# EAGLE design UMN_HASP_2015_HVPS (EAGLE 6.5.0)

## Sheet 1 of 3: HVPS A
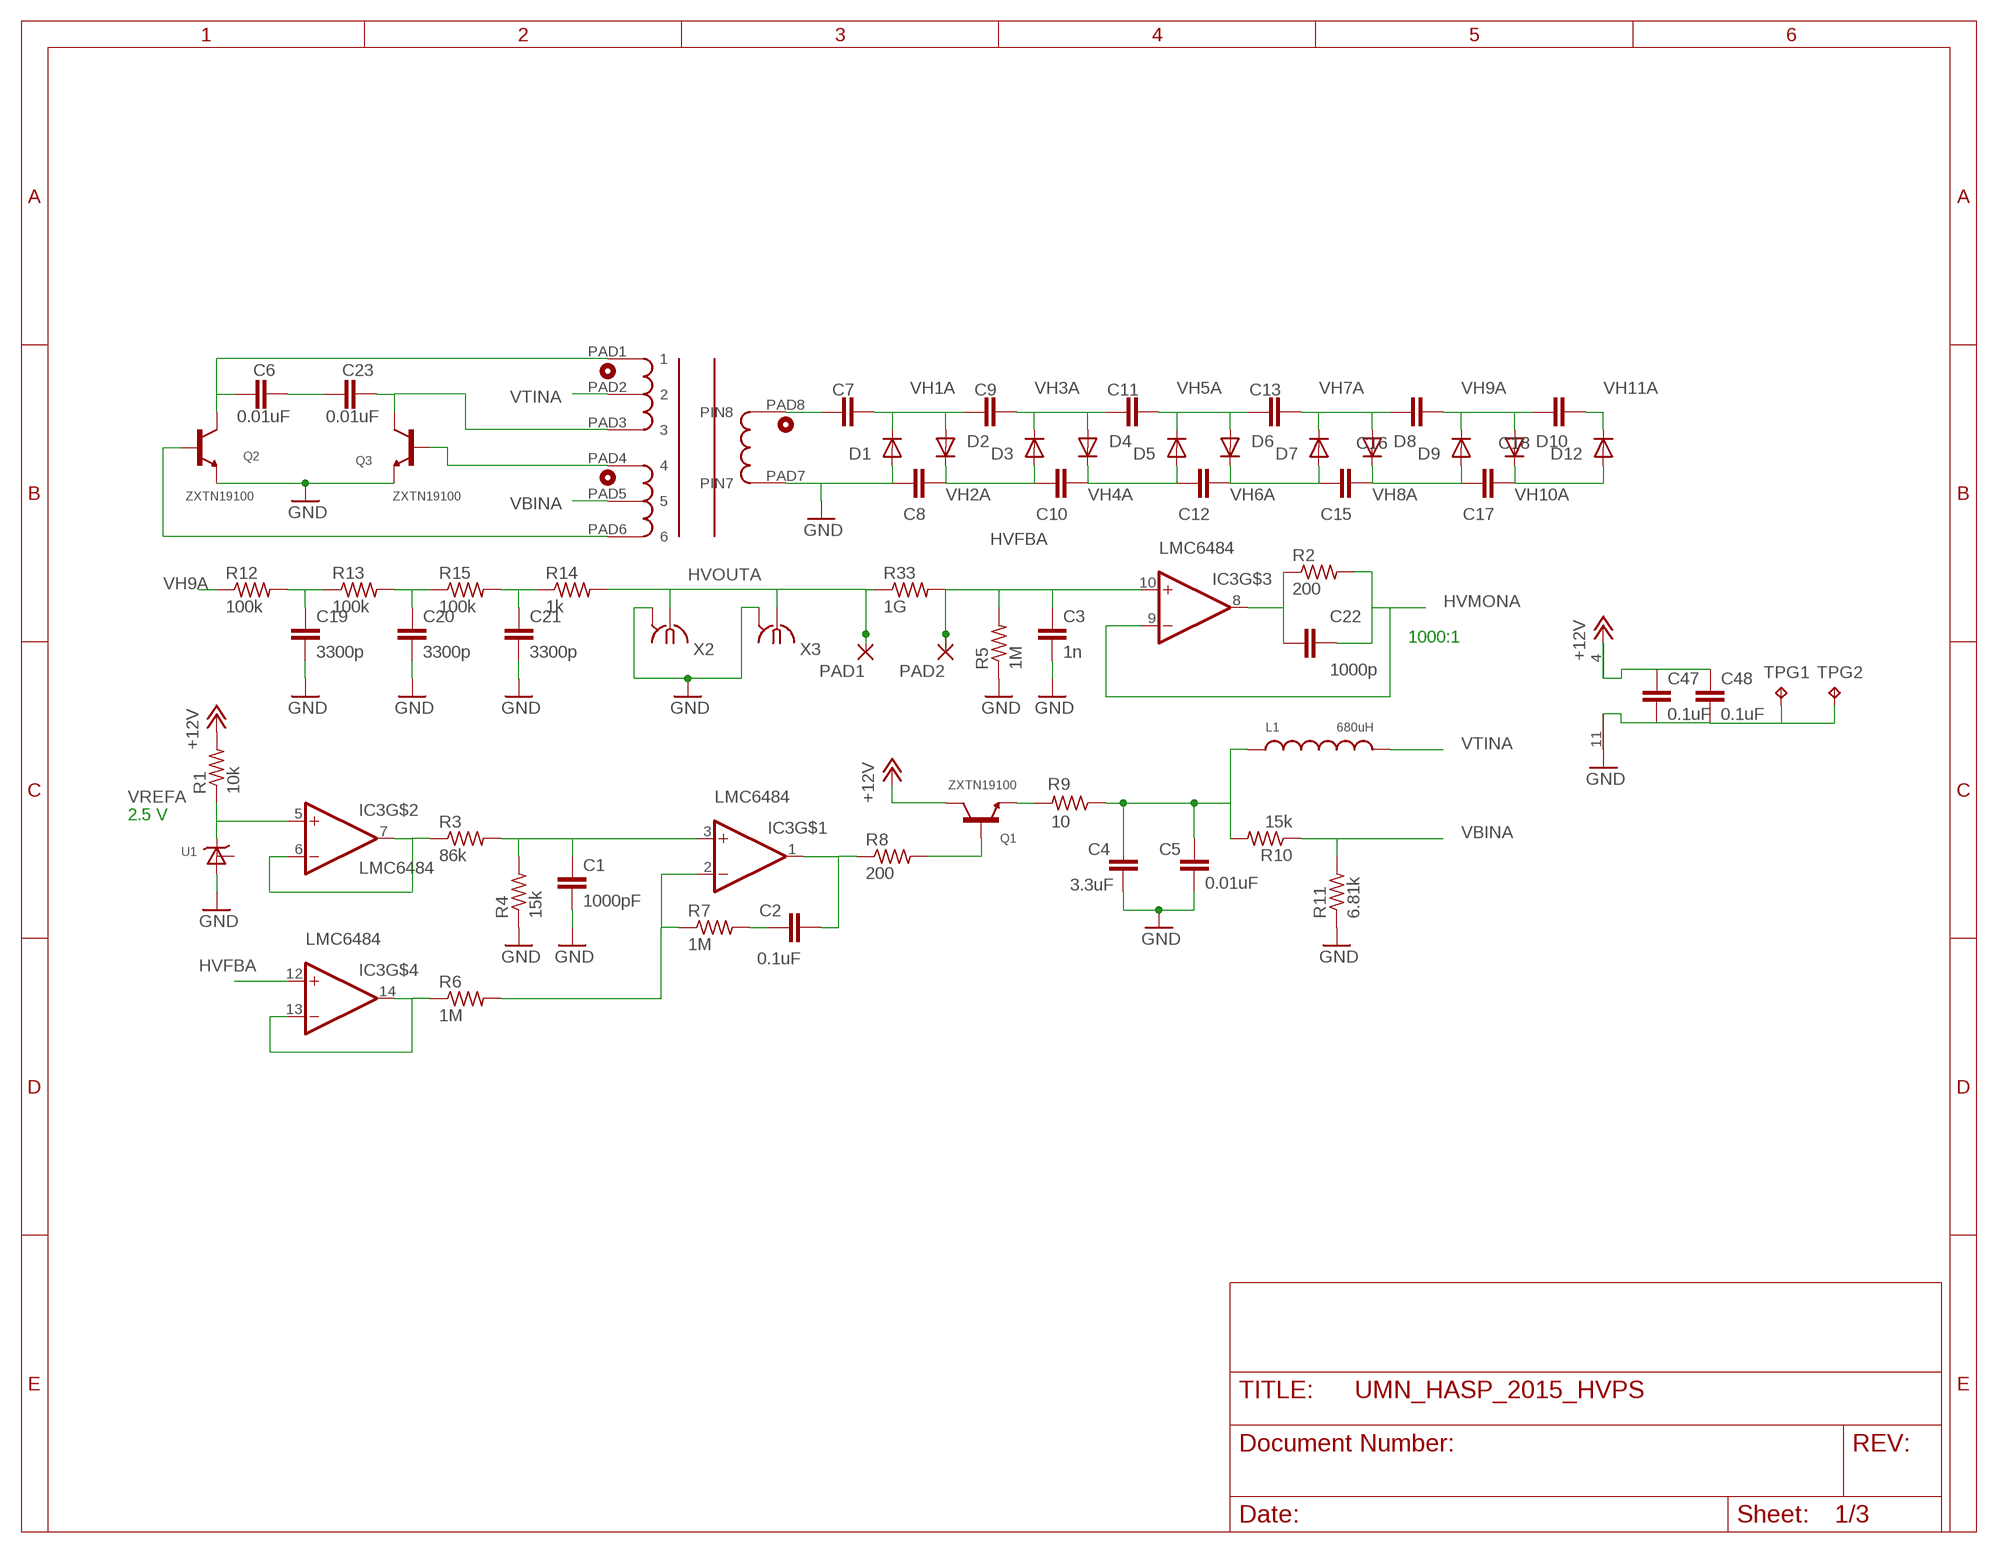
[diagram p0: schematic, sheet 1]

### Parts
C1  1000pF  C-EUC0603  [C0603]
C2  0.1uF  C-EUC0603  [C0603]
C3  1n  C-EUC0603  [C0603]
C4  3.3uF  C-EUC0603  [C0603]
C5  0.01uF  C-EUC0603  [C0603]
C6  0.01uF  C-EUC0603  [C0603]
C7  C-EUC1206K  [C1206K]
C8  C-EUC1206K  [C1206K]
C9  C-EUC1206K  [C1206K]
C10  C-EUC1206K  [C1206K]
C11  C-EUC1206K  [C1206K]
C12  C-EUC1206K  [C1206K]
C13  C-EUC1206K  [C1206K]
C15  C-EUC1206K  [C1206K]
C16  C-EUC1206K  [C1206K]
C17  C-EUC1206K  [C1206K]
C18  C-EUC1206K  [C1206K]
C19  3300p  C-EUC1206  [C1206]
C20  3300p  C-EUC1206  [C1206]
C21  3300p  C-EUC1206  [C1206]
C22  1000p  C-EUC0603  [C0603]
C23  0.01uF  C-EUC0603  [C0603]
C47  0.1uF  C-EUC0603  [C0603]
C48  0.1uF  C-EUC0603  [C0603]
D1  DIODE-DO-214AC  [DO-214AC]
D2  DIODE-DO-214AC  [DO-214AC]
D3  DIODE-DO-214AC  [DO-214AC]
D4  DIODE-DO-214AC  [DO-214AC]
D5  DIODE-DO-214AC  [DO-214AC]
D6  DIODE-DO-214AC  [DO-214AC]
D7  DIODE-DO-214AC  [DO-214AC]
D8  DIODE-DO-214AC  [DO-214AC]
D9  DIODE-DO-214AC  [DO-214AC]
D10  DIODE-DO-214AC  [DO-214AC]
D12  DIODE-DO-214AC  [DO-214AC]
IC3  LMC6484  [SO14]
L1  680uH  INDUCTOR_BOURNS_SRR1280_SERIES  [INDUCTOR_SRR1280BOURNS]
PAD1  WIREPADSMD1,27-254  [SMD1,27-2,54]
PAD2  WIREPADSMD1,27-254  [SMD1,27-2,54]
Q1  ZXTN19100  ZXTN19100_NPN  [SOT23_2CM_SQ_AREA]
Q2  ZXTN19100  ZXTN19100_NPN  [SOT23_2CM_SQ_AREA]
Q3  ZXTN19100  ZXTN19100_NPN  [SOT23_2CM_SQ_AREA]
R1  10k  R-US_R0603  [R0603]
R2  200  R-US_R0603  [R0603]
R3  86k  R-US_R0603  [R0603]
R4  15k  R-US_R0603  [R0603]
R5  1M  R-US_R0603  [R0603]
R6  1M  R-US_R0603  [R0603]
R7  1M  R-US_R0603  [R0603]
R8  200  R-US_R0603  [R0603]
R9  10  R-US_R2010  [R2010]
R10  15k  R-US_R0603  [R0603]
R11  6.81k  R-US_R0603  [R0603]
R12  100k  R-US_R0603  [R0603]
R13  100k  R-US_R0603  [R0603]
R14  1k  R-US_R0603  [R0603]
R15  100k  R-US_R0603  [R0603]
R33  1G  R-US_R2512  [R2512]
TPG1  TPB1,27  [B1,27]
TPG2  TPB1,27  [B1,27]
U1  ADR525  [SOT23A]
U$1  TDK_TRANSFORMER_RM6_CORE  [SM_DCOILFORMER_RM6]
X2  BU-SMA-V-REVB  [BU-SMA-V]
X3  BU-SMA-V-REVB  [BU-SMA-V]

### Nets
+12V: C47.1 C48.1 IC3.4(V+) Q1.C R1.2 ; also sheet 2,3
GND: C1.2 C3.2 C4.2 C5.2 C8.1 C19.2 C20.2 C21.2 C47.2 C48.2 D1.A IC3.11(V-) Q2.E Q3.E R4.1 R5.1 R11.1 TPG1.TP TPG2.TP U1.2(V-) U$1.PAD7(PIN7) X2.2(GND) X3.2(GND) ; also sheet 2,3
HVFBA: C3.1 IC3.10(+IN) IC3.12(+IN) PAD2.1(P) R5.2 R33.2
HVMONA: C22.1 IC3.9(-IN) R2.2
HVOUTA: PAD1.1(P) R14.2 R33.1 X2.1 X3.1
N$1: C22.2 IC3.8(OUT) R2.1
N$2: IC3.6(-IN) IC3.7(OUT) R3.1
N$3: C1.1 IC3.3(+IN) R3.2 R4.2
N$4: C6.1 C23.2
N$5: IC3.13(-IN) IC3.14(OUT) R6.1
N$6: IC3.2(-IN) R6.2 R7.1
N$7: C6.2 Q2.C U$1.PAD1
N$8: C2.1 R7.2
N$9: C2.2 IC3.1(OUT) R8.1
N$10: C4.1 C5.1 L1.P$1 R9.1 R10.2
N$12: C7.1 U$1.PAD8(PIN8)
N$13: C23.1 Q3.C U$1.PAD3
N$14: C19.1 R12.2 R13.1
N$15: C20.1 R13.2 R15.1
N$16: C21.1 R14.1 R15.2
N$17: Q1.E R9.2
N$18: Q1.B R8.2
N$19: Q3.B U$1.PAD4
N$20: Q2.B U$1.PAD6
VBINA: R10.1 R11.2 U$1.PAD5
VH1A: C7.2 C9.1 D1.C D2.A
VH2A: C8.2 C10.1 D2.C D3.A
VH3A: C9.2 C11.1 D3.C D4.A
VH4A: C10.2 C12.1 D4.C D5.A
VH5A: C11.2 C13.1 D5.C D6.A
VH6A: C12.2 C15.1 D6.C D7.A
VH7A: C13.2 C16.1 D7.C D8.A
VH8A: C15.2 C17.1 D8.C D9.A
VH9A: C16.2 C18.1 D9.C D10.A R12.1
VH10A: C17.2 D10.C D12.A
VH11A: C18.2 D12.C
VREFA: IC3.5(+IN) R1.1 U1.1(V+)
VTINA: L1.P$2 U$1.PAD2
Unconnected: U1.3(TRIM)

### Notes on the sheet
- 1000:1
- 2.5 V

## Sheet 2 of 3: HVPS B
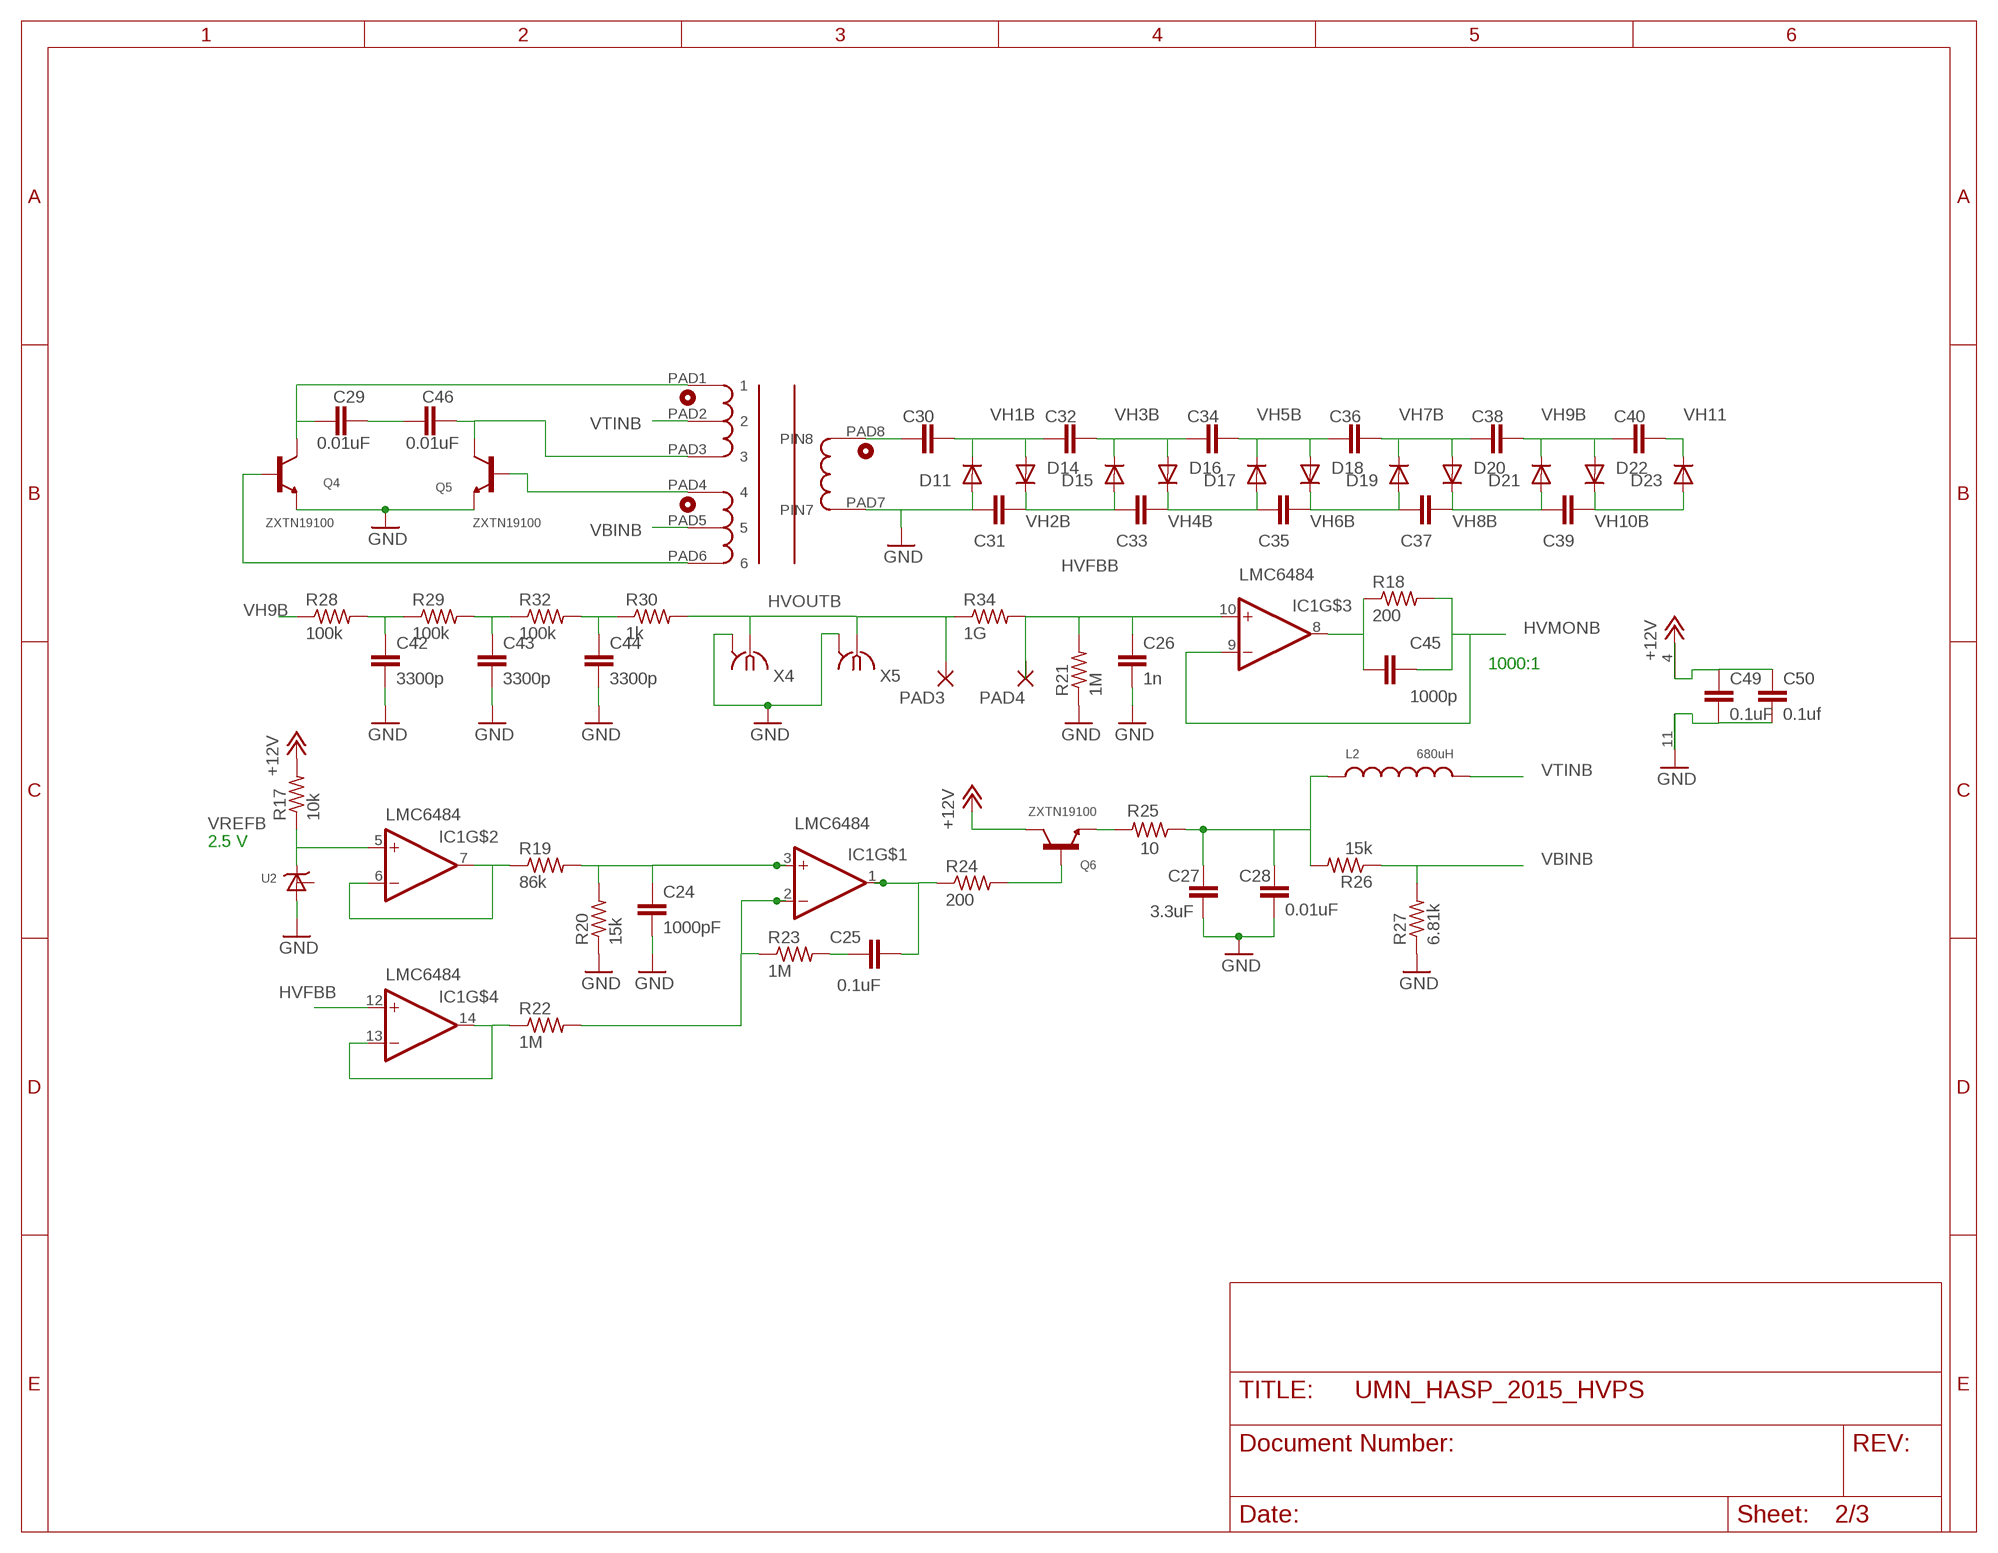
[diagram p1: schematic, sheet 2]

### Parts
C24  1000pF  C-EUC0603  [C0603]
C25  0.1uF  C-EUC0603  [C0603]
C26  1n  C-EUC0603  [C0603]
C27  3.3uF  C-EUC0603  [C0603]
C28  0.01uF  C-EUC0603  [C0603]
C29  0.01uF  C-EUC0603  [C0603]
C30  C-EUC1206K  [C1206K]
C31  C-EUC1206K  [C1206K]
C32  C-EUC1206K  [C1206K]
C33  C-EUC1206K  [C1206K]
C34  C-EUC1206K  [C1206K]
C35  C-EUC1206K  [C1206K]
C36  C-EUC1206K  [C1206K]
C37  C-EUC1206K  [C1206K]
C38  C-EUC1206K  [C1206K]
C39  C-EUC1206K  [C1206K]
C40  C-EUC1206K  [C1206K]
C42  3300p  C-EUC1206  [C1206]
C43  3300p  C-EUC1206  [C1206]
C44  3300p  C-EUC1206  [C1206]
C45  1000p  C-EUC0603  [C0603]
C46  0.01uF  C-EUC0603  [C0603]
C49  0.1uF  C-EUC0603  [C0603]
C50  0.1uf  C-EUC0603  [C0603]
D11  DIODE-DO-214AC  [DO-214AC]
D14  DIODE-DO-214AC  [DO-214AC]
D15  DIODE-DO-214AC  [DO-214AC]
D16  DIODE-DO-214AC  [DO-214AC]
D17  DIODE-DO-214AC  [DO-214AC]
D18  DIODE-DO-214AC  [DO-214AC]
D19  DIODE-DO-214AC  [DO-214AC]
D20  DIODE-DO-214AC  [DO-214AC]
D21  DIODE-DO-214AC  [DO-214AC]
D22  DIODE-DO-214AC  [DO-214AC]
D23  DIODE-DO-214AC  [DO-214AC]
IC1  LMC6484  [SO14]
L2  680uH  INDUCTOR_BOURNS_SRR1280_SERIES  [INDUCTOR_SRR1280BOURNS]
PAD3  WIREPADSMD1,27-254  [SMD1,27-2,54]
PAD4  WIREPADSMD1,27-254  [SMD1,27-2,54]
Q4  ZXTN19100  ZXTN19100_NPN  [SOT23_2CM_SQ_AREA]
Q5  ZXTN19100  ZXTN19100_NPN  [SOT23_2CM_SQ_AREA]
Q6  ZXTN19100  ZXTN19100_NPN  [SOT23_2CM_SQ_AREA]
R17  10k  R-US_R0603  [R0603]
R18  200  R-US_R0603  [R0603]
R19  86k  R-US_R0603  [R0603]
R20  15k  R-US_R0603  [R0603]
R21  1M  R-US_R0603  [R0603]
R22  1M  R-US_R0603  [R0603]
R23  1M  R-US_R0603  [R0603]
R24  200  R-US_R0603  [R0603]
R25  10  R-US_R2010  [R2010]
R26  15k  R-US_R0603  [R0603]
R27  6.81k  R-US_R0603  [R0603]
R28  100k  R-US_R0603  [R0603]
R29  100k  R-US_R0603  [R0603]
R30  1k  R-US_R0603  [R0603]
R32  100k  R-US_R0603  [R0603]
R34  1G  R-US_R2512  [R2512]
U2  ADR525  [SOT23A]
U$2  TDK_TRANSFORMER_RM6_CORE  [SM_DCOILFORMER_RM6]
X4  BU-SMA-V-REVB  [BU-SMA-V]
X5  BU-SMA-V-REVB  [BU-SMA-V]

### Nets
+12V: C49.1 C50.1 IC1.4(V+) Q6.C R17.2 ; also sheet 1,3
GND: C24.2 C26.2 C27.2 C28.2 C31.1 C42.2 C43.2 C44.2 C49.2 C50.2 D11.A IC1.11(V-) Q4.E Q5.E R20.1 R21.1 R27.1 U2.2(V-) U$2.PAD7(PIN7) X4.2(GND) X5.2(GND) ; also sheet 1,3
HVFBB: C26.1 IC1.10(+IN) IC1.12(+IN) PAD4.1(P) R21.2 R34.2
HVMONB: C45.1 IC1.9(-IN) R18.2
HVOUTB: PAD3.1(P) R30.2 R34.1 X4.1 X5.1
N$11: IC1.6(-IN) IC1.7(OUT) R19.1
N$22: C24.1 IC1.3(+IN) R19.2 R20.2
N$23: IC1.13(-IN) IC1.14(OUT) R22.1
N$24: IC1.2(-IN) R22.2 R23.1
N$25: C25.1 R23.2
N$26: C25.2 IC1.1(OUT) R24.1
N$27: C27.1 C28.1 L2.P$1 R25.1 R26.2
N$29: Q6.E R25.2
N$30: Q6.B R24.2
N$31: C29.2 Q4.C U$2.PAD1
N$32: Q5.B U$2.PAD4
N$33: Q4.B U$2.PAD6
N$34: C30.1 U$2.PAD8(PIN8)
N$36: C42.1 R28.2 R29.1
N$37: C43.1 R29.2 R32.1
N$38: C44.1 R30.1 R32.2
N$39: C45.2 IC1.8(OUT) R18.1
N$41: C29.1 C46.2
N$42: C46.1 Q5.C U$2.PAD3
VBINB: R26.1 R27.2 U$2.PAD5
VH1B: C30.2 C32.1 D11.C D14.A
VH2B: C31.2 C33.1 D14.C D15.A
VH3B: C32.2 C34.1 D15.C D16.A
VH4B: C33.2 C35.1 D16.C D17.A
VH5B: C34.2 C36.1 D17.C D18.A
VH6B: C35.2 C37.1 D18.C D19.A
VH7B: C36.2 C38.1 D19.C D20.A
VH8B: C37.2 C39.1 D20.C D21.A
VH9B: C38.2 C40.1 D21.C D22.A R28.1
VH10B: C39.2 D22.C D23.A
VH11: C40.2 D23.C
VREFB: IC1.5(+IN) R17.1 U2.1(V+)
VTINB: L2.P$2 U$2.PAD2
Unconnected: U2.3(TRIM)

### Notes on the sheet
- 1000:1
- 2.5 V

## Sheet 3 of 3: PC/104
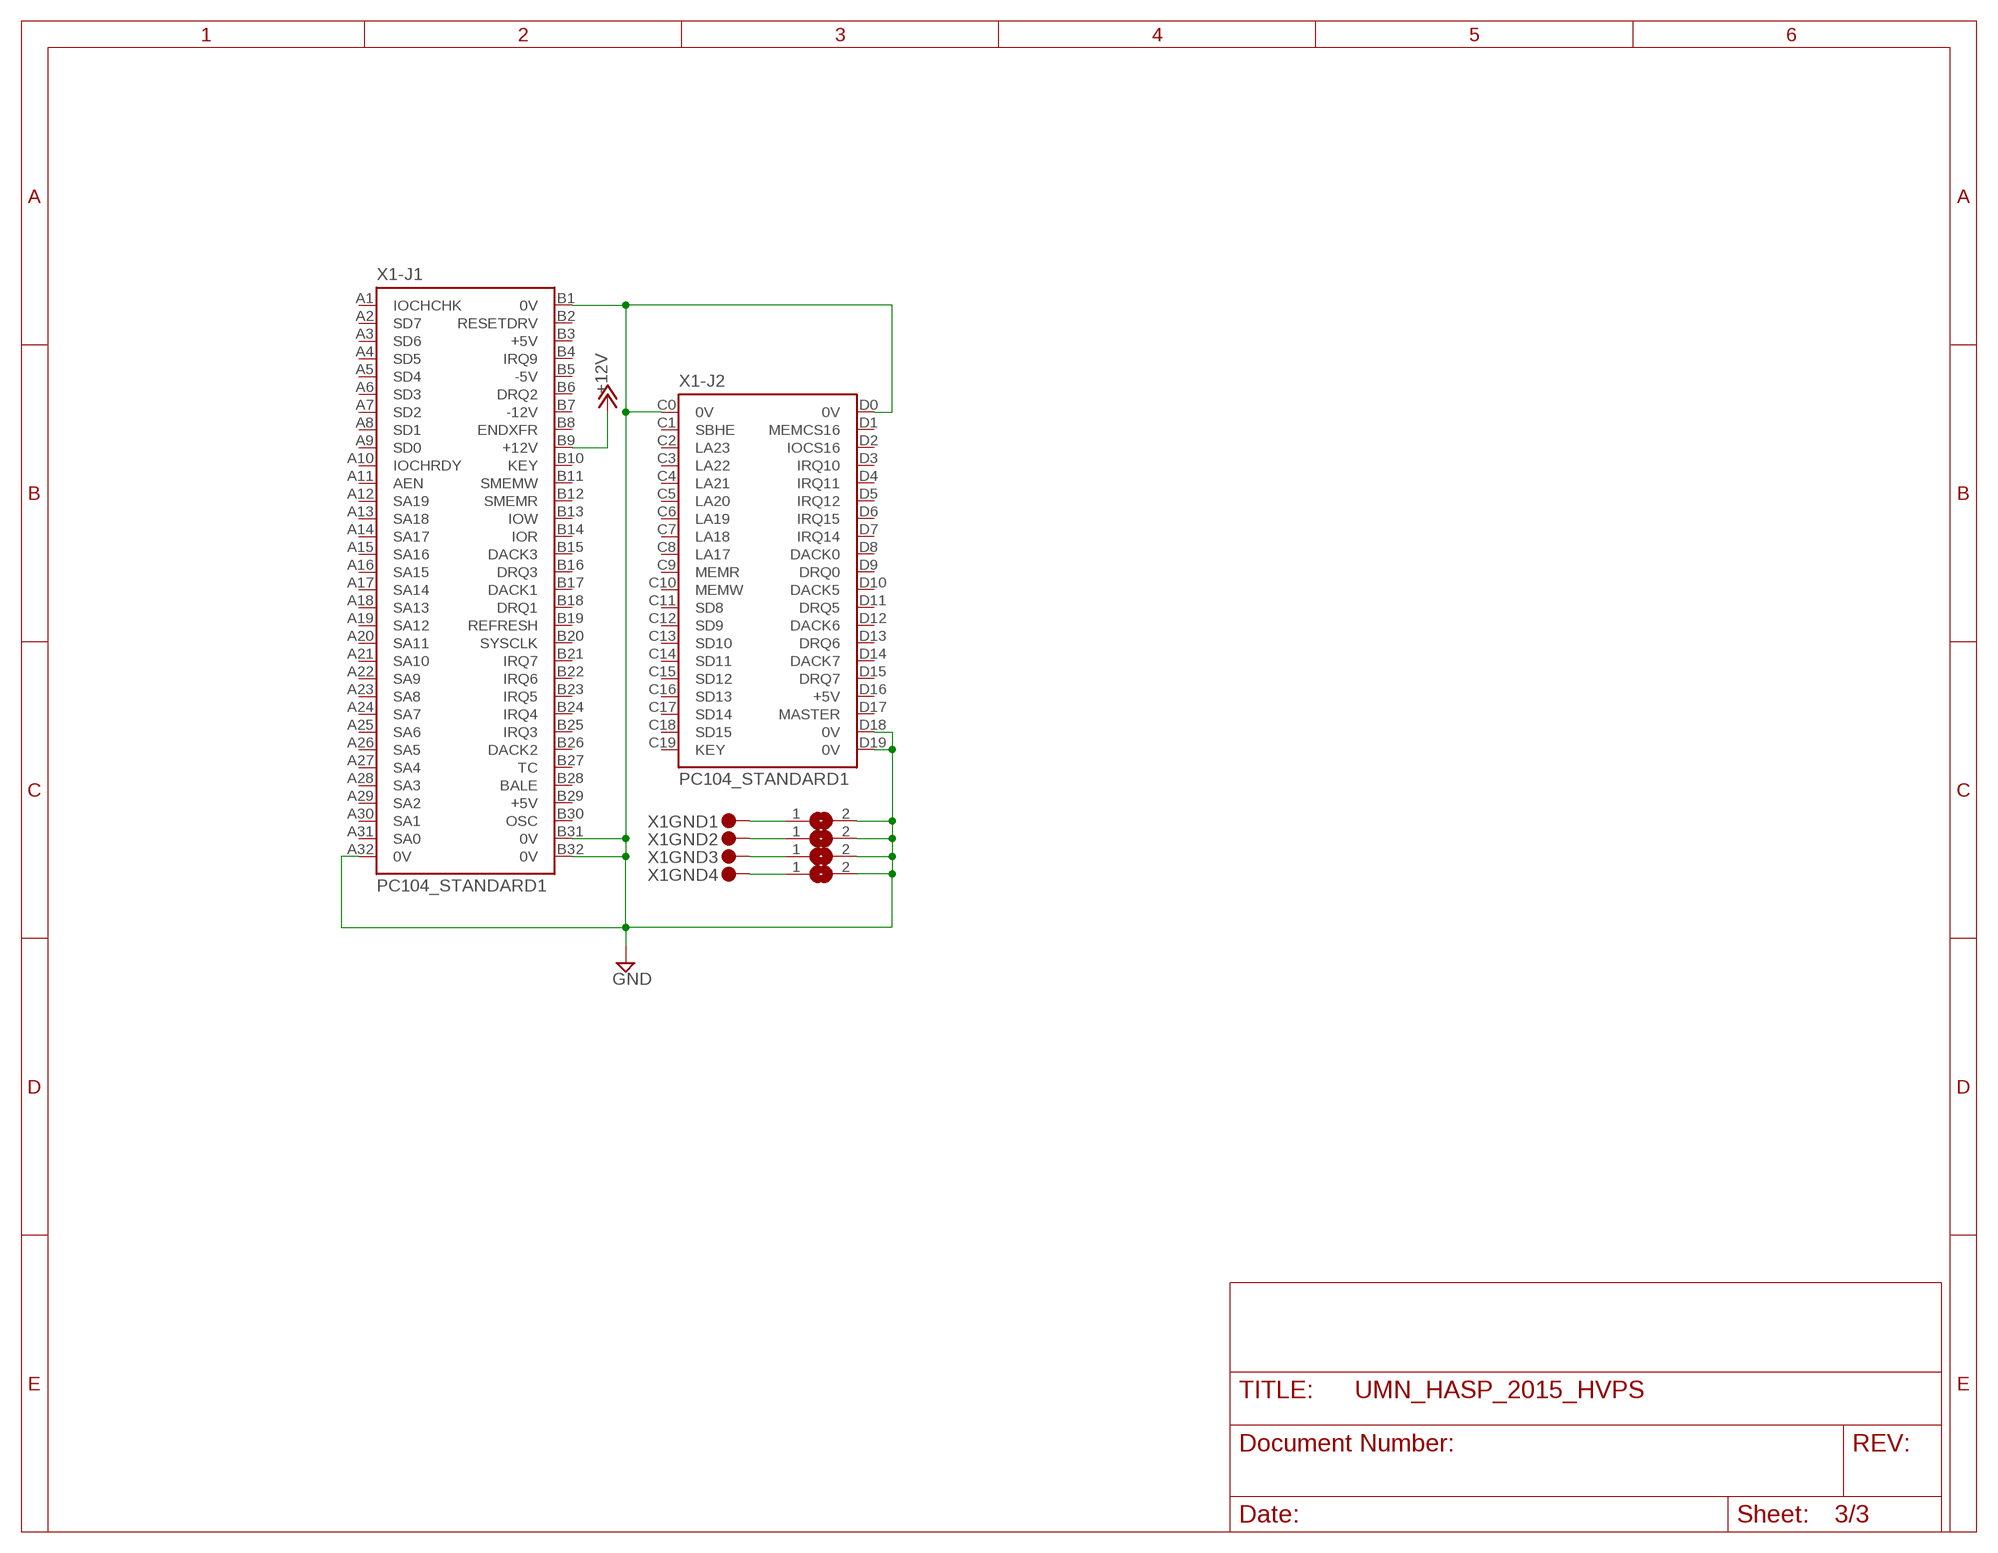
[diagram p2: schematic, sheet 3]

### Parts
SJ1  SJ  [SJ]
SJ2  SJ  [SJ]
SJ3  SJ  [SJ]
SJ4  SJ  [SJ]
X1  PC104_STANDARD1  [PC104-STANDARD]

### Nets
+12V: X1.B9(-J1:+12V) ; also sheet 1,2
GND: SJ1.2 SJ2.2 SJ3.2 SJ4.2 X1.A32(-J1:0V) X1.B1(-J1:0V) X1.B31(-J1:0V) X1.B32(-J1:0V) X1.C0(-J2:0V) X1.D0(-J2:0V) X1.D18(-J2:0V) X1.D19(-J2:0V) ; also sheet 1,2
N$21: SJ1.1 X1.GND@1
N$44: SJ2.1 X1.GND@2
N$45: SJ3.1 X1.GND@3
N$46: SJ4.1 X1.GND@4
Unconnected: X1.A1(-J1:IOCHCHK) X1.A2(-J1:SD7) X1.A3(-J1:SD6) X1.A4(-J1:SD5) X1.A5(-J1:SD4) X1.A6(-J1:SD3) X1.A7(-J1:SD2) X1.A8(-J1:SD1) X1.A9(-J1:SD0) X1.A10(-J1:IOCHRDY) X1.A11(-J1:AEN) X1.A12(-J1:SA19) X1.A13(-J1:SA18) X1.A14(-J1:SA17) X1.A15(-J1:SA16) X1.A16(-J1:SA15) X1.A17(-J1:SA14) X1.A18(-J1:SA13) X1.A19(-J1:SA12) X1.A20(-J1:SA11) X1.A21(-J1:SA10) X1.A22(-J1:SA9) X1.A23(-J1:SA8) X1.A24(-J1:SA7) X1.A25(-J1:SA6) X1.A26(-J1:SA5) X1.A27(-J1:SA4) X1.A28(-J1:SA3) X1.A29(-J1:SA2) X1.A30(-J1:SA1) X1.A31(-J1:SA0) X1.B2(-J1:RESETDRV) X1.B3(-J1:+5V) X1.B4(-J1:IRQ9) X1.B5(-J1:-5V) X1.B6(-J1:DRQ2) X1.B7(-J1:-12V) X1.B8(-J1:ENDXFR) X1.B10(-J1:KEY) X1.B11(-J1:SMEMW) X1.B12(-J1:SMEMR) X1.B13(-J1:IOW) X1.B14(-J1:IOR) X1.B15(-J1:DACK3) X1.B16(-J1:DRQ3) X1.B17(-J1:DACK1) X1.B18(-J1:DRQ1) X1.B19(-J1:REFRESH) X1.B20(-J1:SYSCLK) X1.B21(-J1:IRQ7) X1.B22(-J1:IRQ6) X1.B23(-J1:IRQ5) X1.B24(-J1:IRQ4) X1.B25(-J1:IRQ3) X1.B26(-J1:DACK2) X1.B27(-J1:TC) X1.B28(-J1:BALE) X1.B29(-J1:+5V) X1.B30(-J1:OSC) X1.C1(-J2:SBHE) X1.C2(-J2:LA23) X1.C3(-J2:LA22) X1.C4(-J2:LA21) X1.C5(-J2:LA20) X1.C6(-J2:LA19) X1.C7(-J2:LA18) X1.C8(-J2:LA17) X1.C9(-J2:MEMR) X1.C10(-J2:MEMW) X1.C11(-J2:SD8) X1.C12(-J2:SD9) X1.C13(-J2:SD10) X1.C14(-J2:SD11) X1.C15(-J2:SD12) X1.C16(-J2:SD13) X1.C17(-J2:SD14) X1.C18(-J2:SD15) X1.C19(-J2:KEY) X1.D1(-J2:MEMCS16) X1.D2(-J2:IOCS16) X1.D3(-J2:IRQ10) X1.D4(-J2:IRQ11) X1.D5(-J2:IRQ12) X1.D6(-J2:IRQ15) X1.D7(-J2:IRQ14) X1.D8(-J2:DACK0) X1.D9(-J2:DRQ0) X1.D10(-J2:DACK5) X1.D11(-J2:DRQ5) X1.D12(-J2:DACK6) X1.D13(-J2:DRQ6) X1.D14(-J2:DACK7) X1.D15(-J2:DRQ7) X1.D16(-J2:+5V) X1.D17(-J2:MASTER)

## Power pins joined to a net without a drawn wire
GND: X2.3(GND) X2.4(GND) X2.5(GND) X3.3(GND) X3.4(GND) X3.5(GND) X4.3(GND) X4.4(GND) X4.5(GND) X5.3(GND) X5.4(GND) X5.5(GND)

## Library data of the parts
C1-C13 C15-C40 C42-C50 = resistor:C-EU: CAPACITOR, European symbol
D1-D12 D14-D23 = diode:DIODE-: DIODE
IC1 IC3 = ACommon2:LMC6484: LMC6484 Quad Op Amp from TI (formely National Semiconductor) CMOS
L1 L2 = ACommon2:INDUCTOR_BOURNS_SRR1280_SERIES: Inductor Bourns SRR12890 Series Inductor, SMD Sheilded
PAD1-PAD4 = wirepad:WIREPAD: Wire PAD connect wire on PCB
Q1-Q6 = ACommon:ZXTN19100_NPN: ZXTN19100CFF NPN Transistor from Diodes Inc.
R1-R15 R17-R30 R32-R34 = resistor:R-US_: RESISTOR, American symbol
SJ1-SJ4 = jumper:SJ: SMD solder JUMPER
TPG1 TPG2 = testpad:TP: Test pad
U1 U2 = ACommon2:ADR525: ADR525 Voltage Refernce Shunt Mode
U$1 U$2 = ACommon:TDK_TRANSFORMER_RM6_CORE: Transformer from TDK, RM6 Core, SMD
X1 = con-pc104:PC104_STANDARD: PC/104 Standard 16 bit
X2-X5 = ACommon2:BU-SMA-V-REVB: FEMALE SMA CONNECTOR Radiall distributor RS 112-3794

## Board
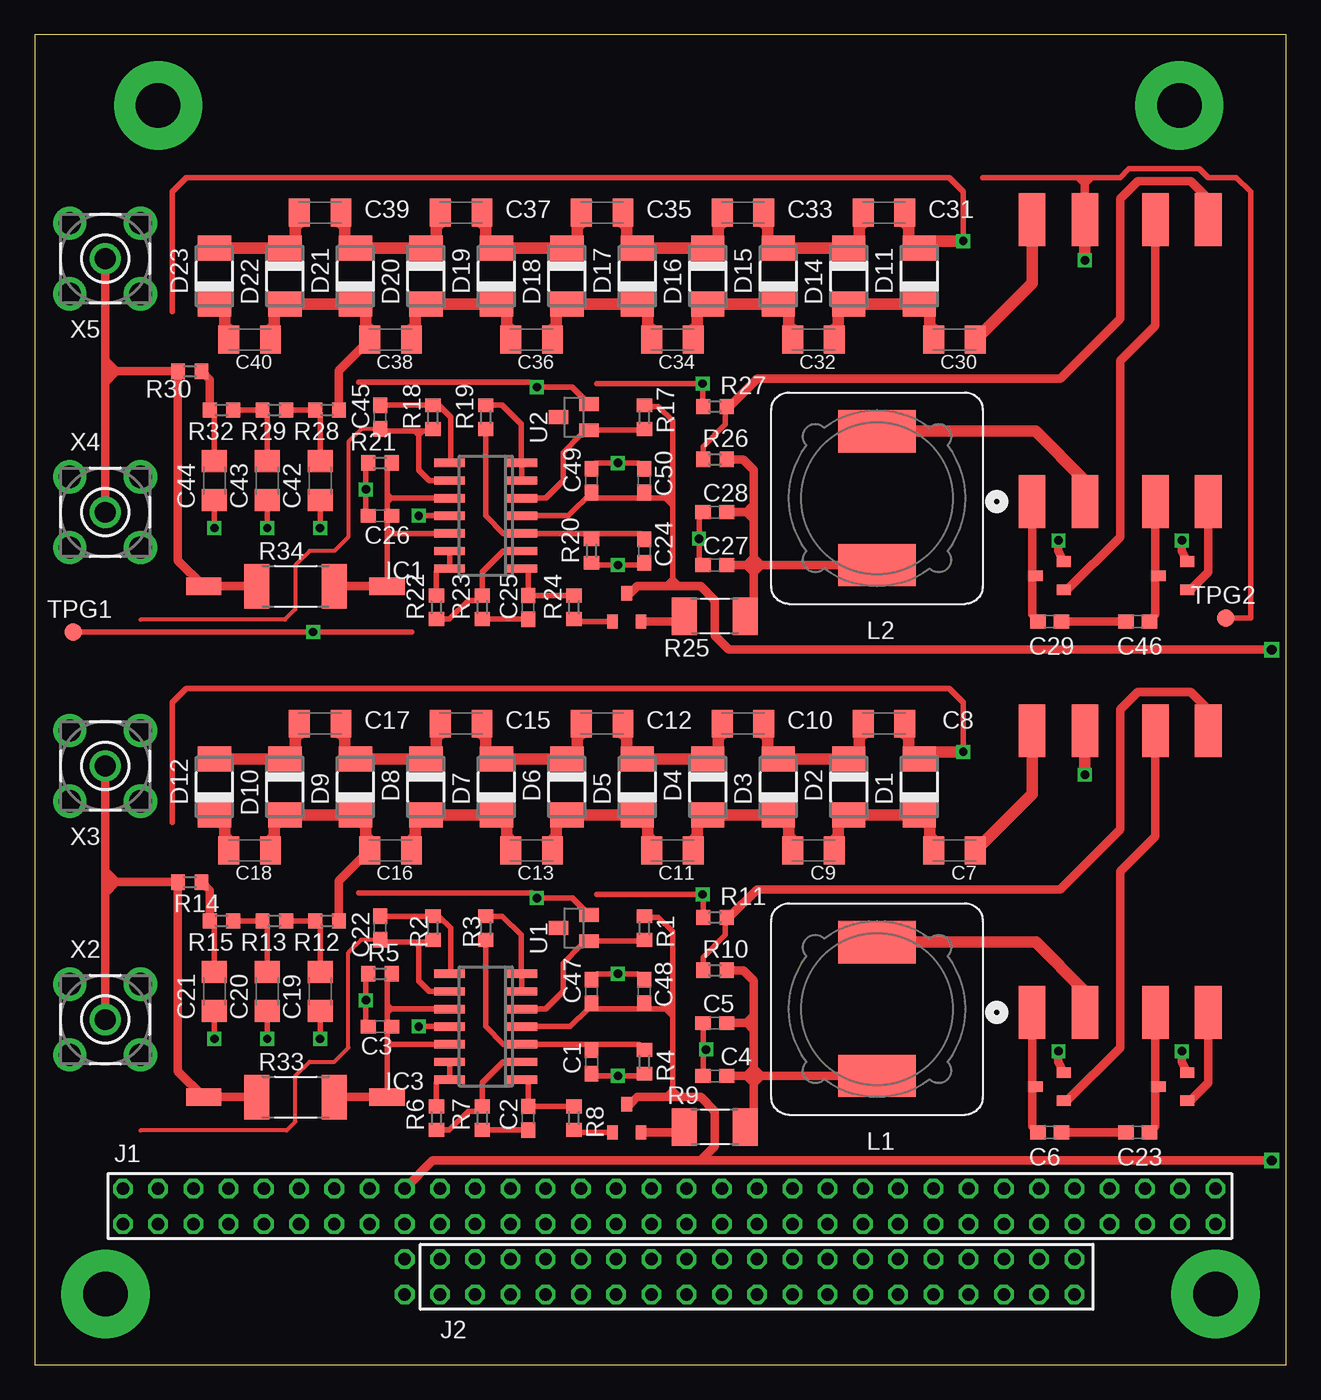
[diagram p3: board, top side]
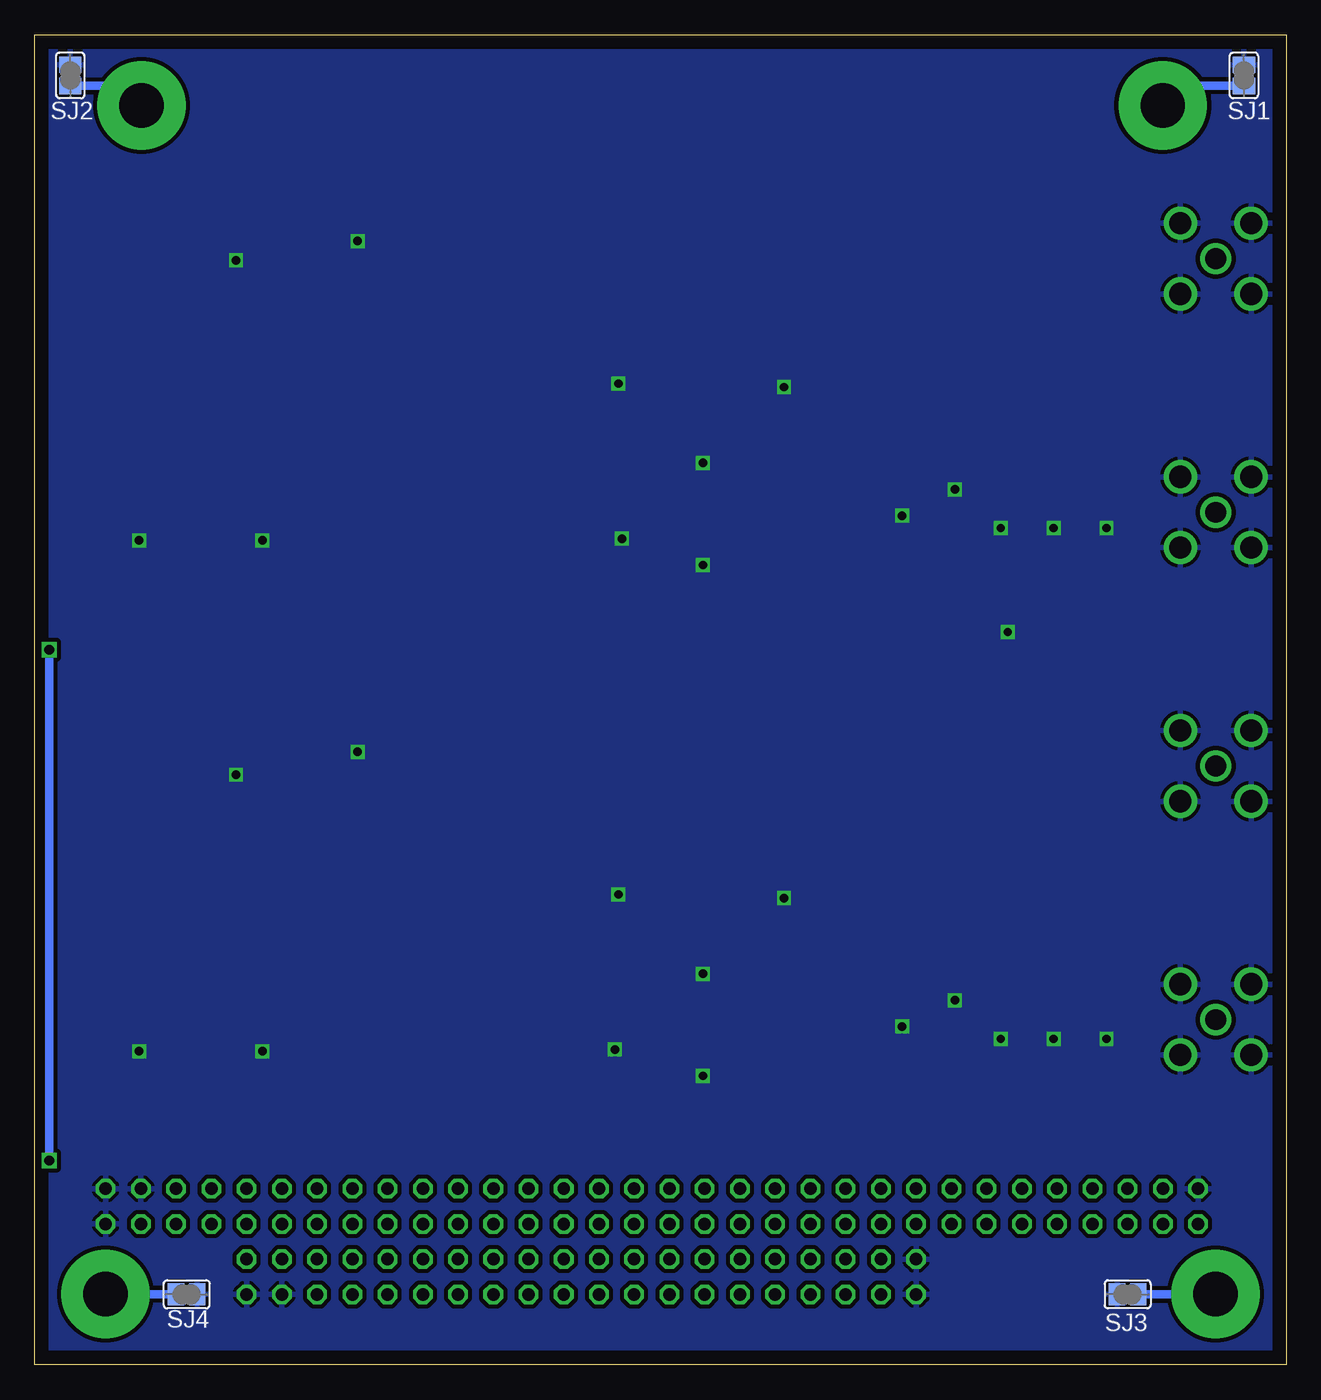
[diagram p4: board, bottom side, seen from below]

Size 90.2 x 95.9 mm. Coordinates in mm from the lower left corner, seen from the top.
Copper layers (1*16): Top 0.035mm / dielectric 1.5mm / Bottom 0.035mm
Design rules "default": minimum track width 10mil, minimum drill 24mil, track to track 8mil, track to pad 8mil, pad to pad 8mil, via to via 8mil, smd to smd 8mil, copper to edge 40mil, drill to drill 8mil, minimum pad ring 10mil, minimum via ring 8mil, stop-mask expansion 4mil, vias tented up to drill 0mil, thermal gap 10mil

### Footprints (pad centres in the part's own frame; a part is rotated, then mirrored left to right if it is on the bottom)
C0603 = smd 1.1 x 1: 1 -0.85,0; 2 0.85,0
C1206K = smd 1.5 x 2: 1 -1.5,0; 2 1.5,0
C1206 = smd 1.6 x 1.8: 1 -1.4,0; 2 1.4,0
DO-214AC = smd 1.8 x 2.4: A 2.025,0; C -2.025,0
SO14 = smd 0.6 x 2.2: 1 -3.81,-2.6; 2 -2.54,-2.6; 3 -1.27,-2.6; 4 0,-2.6; 5 1.27,-2.6; 6 2.54,-2.6; 7 3.81,-2.6; 8 3.81,2.6; 9 2.54,2.6; 10 1.27,2.6; 11 0,2.6; 12 -1.27,2.6; 13 -2.54,2.6; 14 -3.81,2.6
INDUCTOR_SRR1280BOURNS = smd 3.048 x 5.588: P$1 -4.826,0; P$2 4.826,0
SMD1,27-2,54 = smd 1.27 x 2.54: 1 0,0
SOT23_2CM_SQ_AREA = smd 0.762 x 1.016: B 1.016,1.016; C 0,-1.016; E -1.016,1.016
R0603 = smd 1 x 1.1: 1 -0.85,0; 2 0.85,0
R2010 = smd 1.8 x 2.7: 1 -2.2,0; 2 2.2,0
R2512 = smd 1.8 x 3.2: 1 -2.8,0; 2 2.8,0
SJ = smd 1.168 x 1.6: 1 -0.762,0; 2 0.762,0
B1,27 = smd 1.27 x 1.27: TP 0,0
SOT23A = smd 1 x 1.4: 1 -0.95,-1.1; 2 0.95,-1.1; 3 0,1.1
SM_DCOILFORMER_RM6 = smd 3.81 x 1.93: PAD1 -10.16,6.35; PAD2 -10.16,2.54; PAD3 -10.16,-2.54; PAD4 -10.16,-6.35; PAD5 10.16,-6.35; PAD6 10.16,-2.54; PAD7 10.16,2.54; PAD8 10.16,6.35
PC104-STANDARD = drill 0.9 pad 1.397 octagon: A1 6.35,10.16; A2 8.89,10.16; A3 11.43,10.16; A4 13.97,10.16; A5 16.51,10.16; A6 19.05,10.16; A7 21.59,10.16; A8 24.13,10.16; A9 26.67,10.16; A10 29.21,10.16; A11 31.75,10.16; A12 34.29,10.16; A13 36.83,10.16; A14 39.37,10.16; A15 41.91,10.16; A16 44.45,10.16; A17 46.99,10.16; A18 49.53,10.16; A19 52.07,10.16; A20 54.61,10.16; A21 57.15,10.16; A22 59.69,10.16; A23 62.23,10.16; A24 64.77,10.16; A25 67.31,10.16; A26 69.85,10.16; A27 72.39,10.16; A28 74.93,10.16; A29 77.47,10.16; A30 80.01,10.16; A31 82.55,10.16; A32 85.09,10.16; B1 6.35,12.7; B2 8.89,12.7; B3 11.43,12.7; B4 13.97,12.7; B5 16.51,12.7; B6 19.05,12.7; B7 21.59,12.7; B8 24.13,12.7; B9 26.67,12.7; B10 29.21,12.7; B11 31.75,12.7; B12 34.29,12.7; B13 36.83,12.7; B14 39.37,12.7; B15 41.91,12.7; B16 44.45,12.7; B17 46.99,12.7; B18 49.53,12.7; B19 52.07,12.7; B20 54.61,12.7; B21 57.15,12.7; B22 59.69,12.7; B23 62.23,12.7; B24 64.77,12.7; B25 67.31,12.7; B26 69.85,12.7; B27 72.39,12.7; B28 74.93,12.7; B29 77.47,12.7; B30 80.01,12.7; B31 82.55,12.7; B32 85.09,12.7; C0 26.67,7.62; C1 29.21,7.62; C2 31.75,7.62; C3 34.29,7.62; C4 36.83,7.62; C5 39.37,7.62; C6 41.91,7.62; C7 44.45,7.62; C8 46.99,7.62; C9 49.53,7.62; C10 52.07,7.62; C11 54.61,7.62; C12 57.15,7.62; C13 59.69,7.62; C14 62.23,7.62; C15 64.77,7.62; C16 67.31,7.62; C17 69.85,7.62; C18 72.39,7.62; C19 74.93,7.62; D0 26.67,5.08; D1 29.21,5.08; D2 31.75,5.08; D3 34.29,5.08; D4 36.83,5.08; D5 39.37,5.08; D6 41.91,5.08; D7 44.45,5.08; D8 46.99,5.08; D9 49.53,5.08; D10 52.07,5.08; D11 54.61,5.08; D12 57.15,5.08; D13 59.69,5.08; D14 62.23,5.08; D15 64.77,5.08; D16 67.31,5.08; D17 69.85,5.08; D18 72.39,5.08; D19 74.93,5.08 | drill 3.2 pad 6.35: GND@1 8.9,90.8; GND@2 82.5,90.8; GND@3 5.1,5.1; GND@4 85.1,5.1
BU-SMA-V = drill 1.5: 1 0,0 | drill 1.6: 2 -2.55,2.55; 3 2.55,2.55; 4 2.55,-2.55; 5 -2.55,-2.55

### Placement (x,y rotation side)
C1  40.13,21.84 270 top
C2  35.56,17.78 90 top
C3  24.89,24.38 180 top
C4  49.02,20.83 180 top
C5  49.02,24.64 180 top
C6  73.15,16.76 180 top
C7  66.29,37.08 180 top
C8  61.21,46.23 180 top
C9  56.13,37.08 180 top
C10  51.05,46.23 180 top
C11  45.97,37.08 180 top
C12  40.89,46.23 180 top
C13  35.81,37.08 180 top
C15  30.73,46.23 180 top
C16  25.65,37.08 180 top
C17  20.57,46.23 180 top
C18  15.49,37.08 180 top
C19  20.57,26.92 270 top
C20  16.76,26.92 270 top
C21  12.95,26.92 270 top
C22  24.89,31.5 90 top
C23  79.5,16.76 180 top
C24  43.94,58.67 270 top
C25  35.56,54.61 90 top
C26  24.89,61.21 180 top
C27  49.02,57.66 180 top
C28  49.02,61.47 180 top
C29  73.15,53.59 180 top
C30  66.29,73.91 180 top
C31  61.21,83.06 180 top
C32  56.13,73.91 180 top
C33  51.05,83.06 180 top
C34  45.97,73.91 180 top
C35  40.89,83.06 180 top
C36  35.81,73.91 180 top
C37  30.73,83.06 180 top
C38  25.65,73.91 180 top
C39  20.57,83.06 180 top
C40  15.49,73.91 180 top
C42  20.57,63.75 270 top
C43  16.76,63.75 270 top
C44  12.95,63.75 270 top
C45  24.89,68.33 90 top
C46  79.5,53.59 180 top
C47  40.13,26.92 90 top
C48  43.94,26.92 90 top
C49  40.13,63.75 90 top
C50  43.94,63.75 90 top
D1  63.75,41.66 90 top
D2  58.67,41.66 270 top
D3  53.59,41.66 90 top
D4  48.51,41.66 270 top
D5  43.43,41.66 90 top
D6  38.35,41.66 270 top
D7  33.27,41.66 90 top
D8  28.19,41.66 270 top
D9  23.11,41.66 90 top
D10  18.03,41.66 270 top
D11  63.75,78.49 90 top
D12  12.95,41.66 90 top
D14  58.67,78.49 270 top
D15  53.59,78.49 90 top
D16  48.51,78.49 270 top
D17  43.43,78.49 90 top
D18  38.35,78.49 270 top
D19  33.27,78.49 90 top
D20  28.19,78.49 270 top
D21  23.11,78.49 90 top
D22  18.03,78.49 270 top
D23  12.95,78.49 90 top
IC1  32.51,61.21 90 top
IC3  32.51,24.38 90 top
L1  60.71,25.65 90 top
L2  60.71,62.48 90 top
PAD1  12.19,19.3 90 top
PAD2  25.4,19.3 90 top
PAD3  12.19,56.13 90 top
PAD4  25.4,56.13 90 top
Q1  42.67,17.78 180 top
Q2  73.15,20.07 270 top
Q3  82.04,20.07 270 top
Q4  73.15,56.9 270 top
Q5  82.04,56.9 270 top
Q6  42.67,54.61 180 top
R1  43.94,31.5 90 top
R2  28.7,31.5 270 top
R3  32.51,31.5 270 top
R4  43.94,21.84 90 top
R5  24.89,28.19 0 top
R6  28.96,17.78 270 top
R7  32.26,17.78 270 top
R8  38.86,17.78 270 top
R9  49.02,17.14 180 top
R10  49.02,28.45 0 top
R11  49.02,32.26 0 top
R12  21.08,32 180 top
R13  17.27,32 180 top
R14  11.18,34.8 180 top
R15  13.46,32 180 top
R17  43.94,68.33 90 top
R18  28.7,68.33 270 top
R19  32.51,68.33 270 top
R20  40.13,58.67 90 top
R21  24.89,65.02 0 top
R22  28.96,54.61 270 top
R23  32.26,54.61 270 top
R24  38.86,54.61 270 top
R25  49.02,53.98 180 top
R26  49.02,65.28 0 top
R27  49.02,69.09 0 top
R28  21.08,68.83 180 top
R29  17.27,68.83 180 top
R30  11.18,71.63 180 top
R32  13.46,68.83 180 top
R33  18.8,19.3 0 top
R34  18.8,56.13 0 top
SJ1  3.05,92.96 90 bottom
SJ2  87.63,92.96 90 bottom
SJ3  11.43,5.08 180 bottom
SJ4  79.25,5.08 0 bottom
TPG1  2.79,52.83 0 top
TPG2  85.85,53.85 0 top
U1  38.86,31.5 90 top
U2  38.86,68.33 90 top
U$1  78.23,35.56 90 top
U$2  78.23,72.39 90 top
X1  0,0 0 top
X2  5.08,24.89 0 top
X3  5.08,43.18 0 top
X4  5.08,61.47 0 top
X5  5.08,79.76 0 top

### Tracks (layer width: path | path; a pad name or v marks a point on that pad's centre or on a via)
+12V  (via drill 0.7)
  Top 0.406: 43.94,25.78 C48.1 43.94,25.91 44.2,25.65 | 40.13,62.48 C49.1 38.44,61.21 IC1.4 | 40.13,62.48 43.94,62.48 | 43.94,62.48 C50.1 | 43.94,62.48 45.47,62.48 | 45.47,62.48 45.72,62.48 | 45.72,62.48 45.97,62.48 | 45.97,62.48 45.97,62.23 | 45.97,62.23 45.97,61.98 | 45.97,61.98 45.97,56.64 | 45.97,56.64 45.97,56.13 | 45.97,56.64 46.48,56.13 | 45.97,56.64 45.47,56.13 | 40.13,62.48 39.88,62.48 | 45.97,62.99 45.97,68.07 44.96,69.09 44.03,69.09 R17.2 | 45.97,62.99 45.97,62.74 | 45.97,62.74 45.97,62.48 | 45.72,62.48 45.97,62.74 | 45.72,62.48 45.97,62.23 | 45.47,62.48 45.97,62.99 | 45.47,62.48 45.97,61.98 | 44.2,25.65 40.55,25.65 | 40.55,25.65 C47.1 | IC3.4 38.61,24.38 39.88,25.65 40.55,25.65 | 44.2,25.65 45.47,25.65 | 45.47,25.65 45.97,25.65 | 45.97,25.65 45.97,25.15 | 45.97,25.15 45.97,19.81 | 45.97,19.81 45.97,19.3 | 45.97,25.65 45.97,26.16 | 45.97,26.16 45.97,31.24 44.96,32.26 44.03,32.26 R1.2 | 45.97,19.81 46.48,19.3 | 45.97,19.81 45.47,19.3 | 45.47,25.65 45.97,26.16 | 45.47,25.65 45.97,25.15
  Top 0.61: Q6.C 42.93,55.63 43.43,56.13 45.47,56.13 45.97,56.13 46.48,56.13 48.01,56.13 49.02,55.12 49.02,52.58 50.04,51.56 v89.15,51.56 | Q1.C 42.93,18.8 43.43,19.3 45.47,19.3 45.97,19.3 46.48,19.3 48.01,19.3 49.02,18.29 49.02,15.75 48.01,14.73 | X1.B9 28.7,14.73 48.01,14.73 | v89.15,14.73 48.01,14.73
  Bottom 0.61: v89.15,14.73 v89.15,51.56
GND  (via drill 0.6)
  Top 0.406: 68.33,85.6 75.18,85.6 | 75.18,85.6 75.44,85.6 | 75.44,85.6 75.69,85.6 | 75.69,85.6 75.95,85.6 | 75.95,85.6 76.2,85.6 | 76.2,85.6 78.23,85.6 78.87,86.23 83.95,86.23 84.58,85.6 86.61,85.6 87.63,84.58 87.63,53.85 TPG2.TP | 23.37,70.87 35.81,70.87 v36.2,70.48 38.75,70.48 U2.2 | 23.37,34.04 35.81,34.04 v36.2,33.66 38.75,33.66 U1.2 | C44.2 v12.95,60.33 | C43.2 v16.76,60.33 | C42.2 v20.57,60.33 | C21.2 v12.95,23.5 | C20.2 v16.76,23.5 | C19.2 v20.57,23.5 | v27.69,24.38 IC3.11 | v27.69,61.21 IC1.11 | R21.1 23.88,65.02 v23.88,63.12 23.88,61.21 C26.2 | C49.2 40.39,65.02 v42.04,65.02 43.52,65.02 C50.2 | C28.2 47.88,61.21 v47.88,59.56 47.88,57.4 C27.2 | C5.2 48.17,22.73 v48.39,22.73 48.17,22.52 C4.2 | v66.93,81.03 66.93,84.58 65.91,85.6 10.92,85.6 9.91,84.58 9.91,75.95 | v66.93,44.2 66.93,47.75 65.91,48.77 10.92,48.77 9.91,47.75 9.91,39.12 | 75.69,85.6 75.69,85.34 | 75.69,85.34 75.69,85.09 | TPG1.TP v20.07,52.83 27.18,52.83 | 40.51,70.74 v48.13,70.74 48.13,69.13 R27.1 | R20.1 40.3,57.66 v42.04,57.66 43.78,57.66 C24.2 | 75.69,85.34 75.95,85.6 | 75.69,85.34 75.44,85.6 | 75.69,85.09 76.2,85.6 | 75.69,85.09 75.18,85.6 | C47.2 40.55,28.19 v42.04,28.19 43.43,28.19 43.85,27.77 C48.2 | C1.2 40.3,20.83 v42.04,20.83 43.78,20.83 R4.1 | C3.2 23.88,24.55 v23.88,26.29 23.88,28.03 R5.1 | R11.1 48.17,33.87 v48.13,33.91 40.51,33.91
  Top 0.61: v73.79,22.61 73.79,21.84 Q2.E | v82.68,22.61 82.68,21.84 Q3.E | v73.79,59.44 73.79,58.67 Q4.E | v82.68,59.44 82.68,58.67 Q5.E | U$2.PAD7 75.69,85.09
  Top 0.813: v75.69,42.55 U$1.PAD7 | v75.69,79.63 U$2.PAD7 | v66.93,81.03 64.27,81.03 D11.A 62.99,81.27 62.99,82.04 62.71,82.32 C31.1 | C8.1 62.71,45.49 62.99,45.21 62.99,44.44 D1.A 64.27,44.2 v66.93,44.2
  pour Bottom (isolate 0.305): 0,0 90.17,0 90.17,96.01 0,96.01
HVFBA
  Top 0.406: PAD2.1 25.4,22.86 | 25.4,22.86 25.4,23.11 | 25.4,23.11 25.4,23.37 | 25.4,23.37 25.4,24.38 | 25.4,24.38 25.4,25.4 | 25.4,25.4 25.4,25.65 | 25.4,25.65 25.4,25.91 | 25.4,25.91 25.4,27.85 R5.2 | IC3.12 25.65,23.11 | 25.65,23.11 25.4,23.11 | IC3.10 25.65,25.65 | 25.65,25.65 25.4,25.65 | 25.4,25.4 25.65,25.65 | 25.65,25.65 25.4,25.91 | 25.65,23.11 25.4,23.37 | 25.65,23.11 25.4,22.86 | C3.1 25.4,24.38
  Top 0.61: PAD2.1 R33.2
HVFBB
  Top 0.406: PAD4.1 25.4,59.69 | 25.4,59.69 25.4,60.2 | 25.4,60.2 25.4,60.87 C26.1 25.4,61.56 25.4,62.23 | IC1.12 25.65,59.94 | 25.65,59.94 25.4,60.2 | R21.2 25.74,64.86 25.4,64.52 25.4,62.74 | 25.4,62.74 25.4,62.23 | IC1.10 25.65,62.48 | 25.65,62.48 25.4,62.23 | 25.65,59.94 25.4,59.69 | 25.65,62.48 25.4,62.74
  Top 0.61: R34.2 PAD4.1
HVMONA
  Top 0.305: 7.62,16.89 18.16,16.89 18.8,17.53 18.8,20.83 19.81,21.84 21.59,21.84 22.61,22.86 22.61,29.72 23.53,30.65 C22.1
  Top 0.406: IC3.9 28.45,26.92 27.69,27.69 27.69,30.23 | C22.1 24.98,30.65 25.15,30.48 27.43,30.48 | 27.43,30.48 27.69,30.48 | 27.69,30.48 27.94,30.48 | 27.94,30.48 28.54,30.48 R2.2 | 27.69,30.23 27.69,30.48 | 27.69,30.23 27.43,30.48 | 27.69,30.23 27.94,30.48
HVMONB
  Top 0.305: 7.62,53.72 18.03,53.72 18.8,54.48 18.8,57.66 19.81,58.67 21.59,58.67 22.61,59.69 22.61,66.55 23.53,67.48 C45.1
  Top 0.406: R18.2 28.7,67.31 27.94,67.31 | 27.94,67.31 27.43,67.31 | 27.43,67.31 25.06,67.31 C45.1 | IC1.9 28.45,63.75 27.69,64.52 27.69,67.06 | 27.69,67.06 27.94,67.31 | 27.69,67.06 27.43,67.31
HVOUTA
  Top 0.61: R33.1 PAD1.1 10.33,21.17 R14.2 5.84,34.8 | 5.84,34.8 5.59,34.8 | 5.59,34.8 5.08,34.8 | 5.08,34.8 5.08,34.29 | 5.08,34.29 5.08,34.04 | 5.08,34.04 X2.1 | X3.1 5.08,35.56 | 5.08,35.56 5.08,35.31 | 5.08,35.31 5.08,34.8 | 5.08,35.31 5.59,34.8 | 5.59,34.8 5.08,34.29 | 5.84,34.8 5.08,35.56 | 5.84,34.8 5.08,34.04
HVOUTB
  Top 0.61: R34.1 PAD3.1 10.33,58 R30.2 5.84,71.63 | 5.84,71.63 5.33,71.63 | 5.33,71.63 5.08,71.63 | 5.08,71.63 5.08,72.39 | 5.08,72.39 X5.1 | X4.1 5.08,70.87 | 5.08,70.87 5.08,71.37 | 5.08,71.37 5.33,71.63 | 5.08,71.63 5.08,71.37 | 5.08,70.87 5.84,71.63 | 5.84,71.63 5.08,72.39
N$1
  Top 0.406: C22.2 R2.1 29.12,32.35 29.97,31.5 29.97,28.25 IC3.8
N$2
  Top 0.406: IC3.6 IC3.7 35.05,28.25 35.05,30.99 33.69,32.35 R3.1
N$3
  Top 0.406: 40.13,23.11 IC3.3 33.78,23.11 32.51,24.38 R3.2 | 40.13,23.11 43.52,23.11 R4.2 | C1.1 40.13,23.11
N$4
  Top 0.61: C6.1 C23.2
N$5
  Top 0.406: IC3.13 IC3.14 29.21,20.57 28.96,20.32 R6.1
N$6
  Top 0.406: IC3.2 33.78,21.84 32.26,20.32 R7.1 31.92,18.29 31.24,18.29 29.88,16.93 R6.2
N$7
  Top 0.61: U$1.PAD1 71.88,20.07 | 71.88,20.07 71.88,17.18 C6.2 | Q2.C 71.88,20.07
N$8
  Top 0.406: C2.1 R7.2
N$9
  Top 0.406: R8.1 C2.2 35.56,20.57 IC3.1
N$10
  Top 0.61: C4.1 51.31,20.83 | 51.31,20.83 51.82,20.83 | 51.82,20.83 51.82,20.32 | 51.82,20.32 51.82,17.74 R9.1 | L1.P$1 52.32,20.83 | 52.32,20.83 51.82,20.83 | R10.2 51.05,28.45 51.82,27.69 51.82,25.15 | 51.82,25.15 51.82,24.64 | 51.82,24.64 51.82,24.13 | 51.82,24.13 51.82,21.34 | 51.82,21.34 51.82,20.83 | C5.1 51.31,24.64 | 51.31,24.64 51.82,24.64 | 51.82,20.32 51.31,20.83 | 51.31,20.83 51.82,21.34 | 51.82,21.34 52.32,20.83 | 52.32,20.83 51.82,20.32 | 51.31,24.64 51.82,24.13 | 51.31,24.64 51.82,25.15
N$11
  Top 0.406: IC1.6 IC1.7 35.05,65.08 35.05,67.82 33.69,69.18 R19.1
N$12
  Top 0.813: C7.1 67.82,37.08 71.88,41.15 U$1.PAD8
N$13
  Top 0.61: U$1.PAD3 80.77,20.07 | 80.77,20.07 80.77,17.18 C23.1 | Q3.C 80.77,20.07
N$14
  Top 0.406: R13.1 R12.2 20.57,31.66 C19.1
N$15
  Top 0.406: R15.1 R13.2 16.76,31.66 C20.1
N$16
  Top 0.406: C21.1 12.95,31.66 R15.2
  Top 0.61: R15.2 12.61,34.21 R14.1
N$17
  Top 0.61: Q1.E 46.44,16.76 R9.2
N$18
  Top 0.406: Q1.B 39.03,16.76 R8.2
N$19
  Top 0.61: Q3.B 83.31,19.05 84.58,20.32 U$1.PAD4
N$20
  Top 0.61: Q2.B 74.42,19.05 78.23,22.86 78.23,35.56 80.77,38.1 U$1.PAD6
N$21
  Bottom 0.61: SJ1.1 7.24,92.2 X1.GND@1
N$22
  Top 0.406: 40.13,59.94 IC1.3 33.78,59.94 32.51,61.21 R19.2 | R20.2 40.13,59.94 | 40.13,59.94 43.69,59.94 C24.1
N$23
  Top 0.406: IC1.13 IC1.14 29.21,57.4 28.96,57.15 R22.1
N$24
  Top 0.406: R22.2 29.88,53.76 31.24,55.12 31.92,55.12 R23.1 32.26,57.15 33.78,58.67 IC1.2
N$25
  Top 0.406: R23.2 C25.1
N$26
  Top 0.406: R24.1 C25.2 35.56,57.15 35.81,57.4 IC1.1
N$27
  Top 0.61: 51.82,57.66 52.32,57.66 | 52.32,57.66 L2.P$1 | R25.1 51.82,53.59 51.82,57.15 | 51.82,57.15 51.82,57.66 | 51.82,57.66 51.82,58.17 | 51.82,58.17 51.82,60.96 | 51.82,60.96 51.82,61.47 | C28.1 51.31,61.47 | 51.31,61.47 51.82,61.47 | C27.1 51.31,57.66 | 51.31,57.66 51.82,57.66 | R26.2 51.05,65.28 51.82,64.52 51.82,61.98 | 51.82,61.98 51.82,61.47 | 51.31,61.47 51.82,61.98 | 51.31,61.47 51.82,60.96 | 51.31,57.66 51.82,58.17 | 51.82,58.17 52.32,57.66 | 52.32,57.66 51.82,57.15 | 51.82,57.15 51.31,57.66
N$29
  Top 0.61: Q6.E 46.44,53.59 R25.2
N$30
  Top 0.406: R24.2 38.99,53.59 Q6.B
N$31
  Top 0.61: U$2.PAD1 71.88,56.9 | 71.88,56.9 71.88,54.1 C29.2 | Q4.C 71.88,56.9
N$32
  Top 0.61: Q5.B 83.31,55.88 84.58,57.15 U$2.PAD4
N$33
  Top 0.61: 81.28,83.06 U$2.PAD6 80.77,74.93 78.23,72.39 78.23,59.69 74.42,55.88 Q4.B
N$34
  Top 0.813: 71.88,81.53 U$2.PAD8 71.88,77.98 67.82,73.91 C30.1
N$36
  Top 0.406: R29.1 R28.2 20.57,68.58 C42.1
N$37
  Top 0.406: R32.1 R29.2 16.76,68.58 C43.1
N$38
  Top 0.406: C44.1 12.95,68.49 R32.2
  Top 0.61: R32.2 12.61,71.04 R30.1
N$39
  Top 0.406: C45.2 R18.1 29.12,69.18 29.97,68.33 29.97,65.08 IC1.8
N$41
  Top 0.61: C29.1 C46.2
N$42
  Top 0.61: U$2.PAD3 80.77,56.9 | 80.77,56.9 80.77,54.1 C46.1 | Q5.C 80.77,56.9
N$44
  Bottom 0.61: SJ2.1 84.16,92.2 X1.GND@2
N$45
  Bottom 0.61: SJ3.1 5.12,5.08 X1.GND@3
N$46
  Bottom 0.61: SJ4.1 85.08,5.08 X1.GND@4
VBINA
  Top 0.406: R10.1 48.17,29.38 49.78,30.99 49.78,32.17 R11.2
  Top 0.61: R11.2 50.04,32.26 52.07,34.29 73.91,34.29 78.23,38.61 78.23,47.24 79.5,48.51 83.31,48.51 84.58,47.24 U$1.PAD5
VBINB
  Top 0.406: R26.1 48.17,66.21 49.78,67.82 49.78,69 R27.2
  Top 0.61: R27.2 49.87,68.92 52.07,71.12 73.91,71.12 78.23,75.44 78.23,84.07 79.5,85.34 83.31,85.34 84.58,84.07 U$2.PAD5
VH1A
  Top 0.813: C7.2 64.79,37.82 64.52,38.1 64.52,38.87 D1.C D2.A 57.91,38.87 57.91,38.1 57.63,37.82 C9.1
VH1B
  Top 0.813: C30.2 64.79,74.65 64.52,74.93 64.52,75.7 D11.C D14.A 57.91,75.7 57.91,74.93 57.63,74.65 C32.1
VH2A
  Top 0.813: C8.2 59.71,45.49 59.44,45.21 59.44,44.44 D2.C D3.A 53.85,43.43 53.85,43.18 52.83,44.2 52.83,45.21 52.55,45.49 C10.1
VH2B
  Top 0.813: C31.2 59.71,82.32 59.44,82.04 59.44,81.27 D14.C D15.A 52.83,81.27 52.83,82.04 52.55,82.32 C33.1
VH3A
  Top 0.813: C9.2 54.63,37.82 54.36,38.1 54.36,38.87 D3.C D4.A 47.75,38.87 47.75,38.1 47.47,37.82 C11.1
VH3B
  Top 0.813: C32.2 54.63,74.65 54.36,74.93 54.36,75.7 D15.C D16.A 47.75,75.7 47.75,74.93 47.47,74.65 C34.1
VH4A
  Top 0.813: C10.2 49.55,45.49 49.28,45.21 49.28,44.44 D4.C D5.A 42.67,44.44 42.67,45.21 42.39,45.49 C12.1
VH4B
  Top 0.813: C33.2 49.55,82.32 49.28,82.04 49.28,81.27 D16.C D17.A 42.67,81.27 42.67,82.04 42.39,82.32 C35.1
VH5A
  Top 0.813: C11.2 44.47,37.82 44.2,38.1 44.2,38.87 D5.C D6.A 37.59,38.87 37.59,38.1 37.31,37.82 C13.1
VH5B
  Top 0.813: C34.2 44.47,74.65 44.2,74.93 44.2,75.7 D17.C D18.A 37.59,75.7 37.59,74.93 37.31,74.65 C36.1
VH6A
  Top 0.813: C15.1 32.23,45.49 32.51,45.21 32.51,44.44 D7.A D6.C 39.12,44.44 39.12,45.21 39.39,45.49 C12.2
VH6B
  Top 0.813: C35.2 39.39,82.32 39.12,82.04 39.12,81.27 D18.C D19.A 32.51,81.27 32.51,82.04 32.23,82.32 C37.1
VH7A
  Top 0.813: C13.2 34.31,37.82 34.04,38.1 34.04,38.87 D7.C D8.A 27.43,38.87 27.43,38.1 27.15,37.82 C16.1
VH7B
  Top 0.813: C36.2 34.31,74.65 34.04,74.93 34.04,75.7 D19.C D20.A 27.43,75.7 27.43,74.93 27.15,74.65 C38.1
VH8A
  Top 0.813: C17.1 22.07,45.49 22.35,45.21 22.35,44.44 D9.A D8.C 28.96,44.44 28.96,45.21 29.23,45.49 C15.2
VH8B
  Top 0.813: C37.2 29.23,82.32 28.96,82.04 28.96,81.27 D20.C D21.A 22.35,81.27 22.35,82.04 22.07,82.32 C39.1
VH9A
  Top 0.61: R12.1 21.93,34.89 23.62,36.58 23.88,36.81 C16.2
  Top 0.813: C16.2 24.15,37.82 23.88,38.1 23.88,38.87 D9.C D10.A 17.27,38.87 17.27,38.1 16.99,37.82 C18.1
VH9B
  Top 0.61: R28.1 21.93,71.69 C38.2
  Top 0.813: C38.2 24.15,74.65 23.88,74.93 23.88,75.7 D21.C D22.A 17.27,75.7 17.27,74.93 16.99,74.65 C40.1
VH10A
  Top 0.813: D12.A D10.C 18.8,44.44 18.8,45.21 19.07,45.49 C17.2
VH10B
  Top 0.813: C39.2 19.07,82.32 18.8,82.04 18.8,81.27 D22.C D23.A
VH11
  Top 0.813: C40.2 13.99,74.65 13.72,74.93 13.72,75.7 D23.C
VH11A
  Top 0.813: C18.2 13.99,37.82 13.72,38.1 13.72,38.87 D12.C
VREFA
  Top 0.406: R1.1 43.94,30.55 U1.1 39.64,30.23 39.37,30.23 38.1,28.96 38.1,26.92 36.83,25.65 IC3.5
VREFB
  Top 0.406: R17.1 43.84,67.38 U2.1 39.64,67.06 39.37,67.06 38.1,65.79 38.1,63.75 36.83,62.48 IC1.5
VTINA
  Top 0.813: L1.P$2 72.14,30.48 75.69,26.92 U$1.PAD2
VTINB
  Top 0.813: L2.P$2 72.14,67.31 75.69,63.75 U$2.PAD2

### Text on the board
Document: University of Minnesota HASP / High Voltage Power Supply | 2015 Rev 1.0